# EAGLE schematic Distribution_Board (EAGLE 9.7.0)
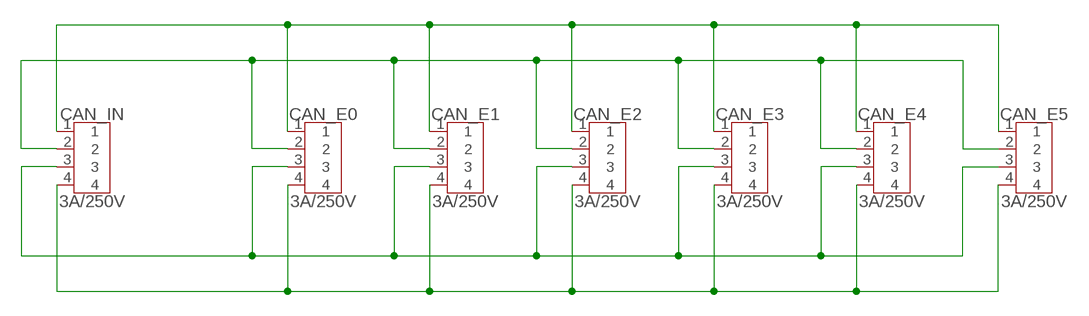
[diagram p0: schematic, sheet 1]

## Parts
CAN_E0  3A/250V  B4B-XH-A  [B4B-XH-A]
CAN_E1  3A/250V  B4B-XH-A  [B4B-XH-A]
CAN_E2  3A/250V  B4B-XH-A  [B4B-XH-A]
CAN_E3  3A/250V  B4B-XH-A  [B4B-XH-A]
CAN_E4  3A/250V  B4B-XH-A  [B4B-XH-A]
CAN_E5  3A/250V  B4B-XH-A  [B4B-XH-A]
CAN_IN  3A/250V  B4B-XH-A  [B4B-XH-A]

## Nets
N$1: CAN_E0.1 CAN_E1.1 CAN_E2.1 CAN_E3.1 CAN_E4.1 CAN_E5.1 CAN_IN.1
N$2: CAN_E0.2 CAN_E1.2 CAN_E2.2 CAN_E3.2 CAN_E4.2 CAN_E5.2 CAN_IN.2
N$3: CAN_E0.4 CAN_E1.4 CAN_E2.4 CAN_E3.4 CAN_E4.4 CAN_E5.4 CAN_IN.4
N$4: CAN_E0.3 CAN_E1.3 CAN_E2.3 CAN_E3.3 CAN_E4.3 CAN_E5.3 CAN_IN.3

## Library data of the parts
CAN_E0 CAN_E1-CAN_E5 CAN_IN = Connector:B4B-XH-A: XH Connector Top Entry - 4POS Details see: Datasheet <http://www.jst-mfg.com/product/pdf/eng/eXH.pdf>; CATEGORY: CONNECTOR; DSECRIPTION: 2.5mm pitch/disconnctable crimp style connector; MANUFACTURER: JST (XH connector); MPN: B4B-XH-A; OPERATING_TEMPERATURE: -25 C to 85 C; PART_STATUS: ACTIVE; ROHS_COMPLIANT: COMPLAINT; SERIES: B4B-XH-A; SUB_CATEGORY: Through hole; TYPE: TOP ENTRY